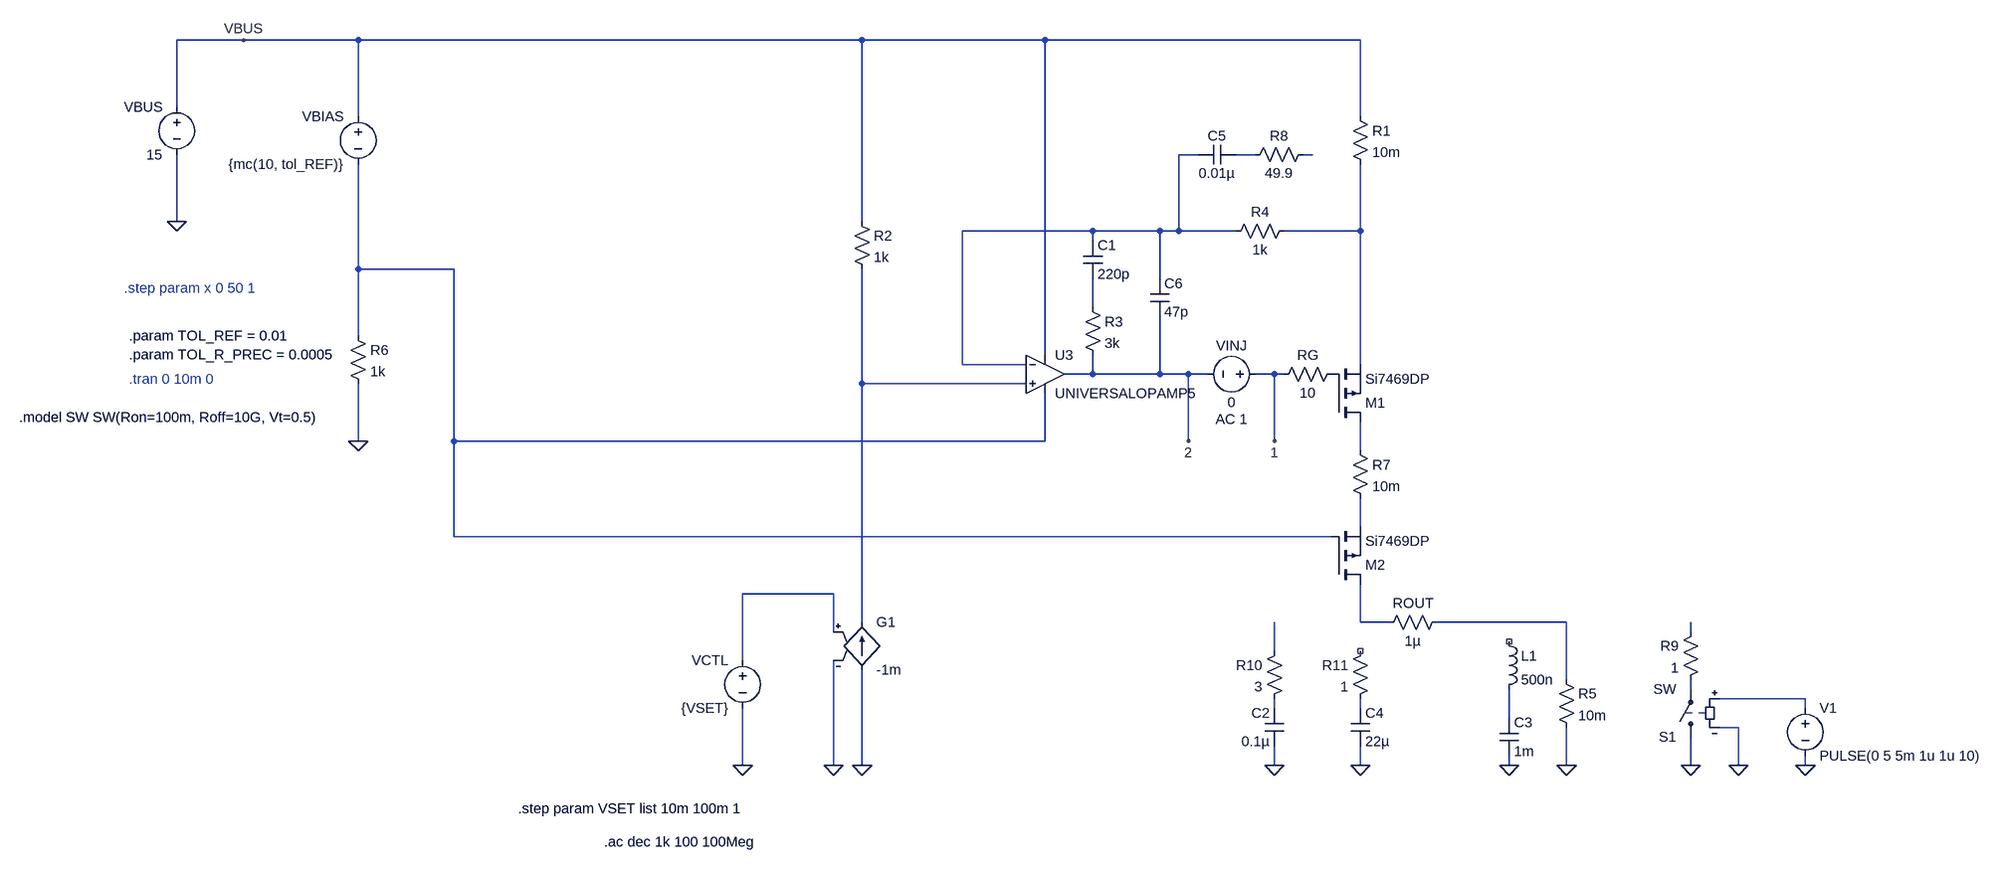
[diagram p0: schematic Voltage_Controlled_Current_Source_AC_Sim.asc]
Voltage_Controlled_Current_Source_AC_Sim.asc, the LTspice schematic file:
Version 4
SHEET 1 2248 1328
WIRE -1600 -32 -1712 -32
WIRE -1408 -32 -1600 -32
WIRE 256 -32 -1408 -32
WIRE 656 -32 256 -32
WIRE 1184 -32 656 -32
WIRE -1712 80 -1712 -32
WIRE -1408 96 -1408 -32
WIRE 1184 96 1184 -32
WIRE 912 160 880 160
WIRE 1008 160 976 160
WIRE 1104 160 1088 160
WIRE -1712 272 -1712 160
WIRE 256 272 256 -32
WIRE 736 288 496 288
WIRE 848 288 736 288
WIRE 880 288 880 160
WIRE 880 288 848 288
WIRE 976 288 880 288
WIRE 1184 288 1184 176
WIRE 1184 288 1056 288
WIRE 736 304 736 288
WIRE -1408 352 -1408 176
WIRE -1184 352 -1408 352
WIRE 848 368 848 288
WIRE 736 416 736 368
WIRE -1408 464 -1408 352
WIRE 656 496 656 -32
WIRE 496 512 496 288
WIRE 624 512 496 512
WIRE 1184 512 1184 288
WIRE 736 528 736 496
WIRE 736 528 688 528
WIRE 848 528 848 432
WIRE 848 528 736 528
WIRE 896 528 848 528
WIRE 928 528 896 528
WIRE 1040 528 1008 528
WIRE 1056 528 1040 528
WIRE 256 544 256 352
WIRE 624 544 256 544
WIRE -1408 640 -1408 544
WIRE -1184 640 -1184 352
WIRE 656 640 656 560
WIRE 656 640 -1184 640
WIRE 896 640 896 528
WIRE 1040 640 1040 528
WIRE 1184 656 1184 608
WIRE 1184 784 1184 736
WIRE -1184 800 -1184 640
WIRE 1136 800 -1184 800
WIRE 208 896 -144 896
WIRE 256 944 256 544
WIRE 1184 944 1184 880
WIRE 1232 944 1184 944
WIRE 1536 944 1312 944
WIRE 208 960 208 896
WIRE 1744 960 1744 944
WIRE 1040 992 1040 944
WIRE -144 1008 -144 896
WIRE 1536 1040 1536 944
WIRE 1744 1056 1744 1040
WIRE 1936 1072 1792 1072
WIRE 1040 1088 1040 1072
WIRE 1184 1088 1184 1072
WIRE 1936 1088 1936 1072
WIRE 1440 1104 1440 1056
WIRE 1824 1120 1792 1120
WIRE -144 1184 -144 1088
WIRE 208 1184 208 1008
WIRE 256 1184 256 1024
WIRE 1040 1184 1040 1152
WIRE 1184 1184 1184 1152
WIRE 1440 1184 1440 1168
WIRE 1536 1184 1536 1120
WIRE 1744 1184 1744 1136
WIRE 1824 1184 1824 1120
WIRE 1936 1184 1936 1168
FLAG -1408 640 0
FLAG -1712 272 0
FLAG -1600 -32 VBUS
FLAG 1536 1184 0
FLAG 1744 1184 0
FLAG 1936 1184 0
FLAG 1824 1184 0
FLAG 1440 1184 0
FLAG 1184 1184 0
FLAG 1040 1184 0
FLAG 256 1184 0
FLAG -144 1184 0
FLAG 208 1184 0
FLAG 896 640 2
FLAG 1040 640 1
SYMBOL voltage -1408 80 M0
WINDOW 123 0 0 Left 0
WINDOW 39 0 0 Left 0
SYMATTR InstName VBIAS
SYMATTR Value {mc(10, tol_REF)}
SYMBOL res -1424 448 R0
SYMATTR InstName R6
SYMATTR Value 1k
SYMBOL voltage -1712 64 M0
WINDOW 123 0 0 Left 0
WINDOW 39 0 0 Left 0
SYMATTR InstName VBUS
SYMATTR Value 15
SYMBOL OpAmps\\UniversalOpAmp5 656 528 R0
SYMATTR InstName U3
SYMATTR Value2 Avol=1Meg GBW=330Meg Phimargin=60 SlewPos=500Meg SlewNeg=500Meg
SYMATTR SpiceLine2 Vos=0 Ibp=2n Ibn=1n Iq=1m Rail=50m Ilimit=50m
SYMBOL pmos 1136 608 M180
SYMATTR InstName M1
SYMATTR Value Si7469DP
SYMBOL res 1520 1024 R0
SYMATTR InstName R5
SYMATTR Value 10m
SYMBOL sw 1744 1152 R180
SYMATTR InstName S1
SYMBOL res 1760 944 M0
SYMATTR InstName R9
SYMATTR Value 1
SYMBOL res 1152 512 R90
WINDOW 0 0 56 VBottom 2
WINDOW 3 32 56 VTop 2
SYMATTR InstName RG
SYMATTR Value 10
SYMBOL voltage 1936 1072 R0
WINDOW 123 0 0 Left 0
WINDOW 39 0 0 Left 0
SYMATTR InstName V1
SYMATTR Value PULSE(0 5 5m 1u 1u 10)
SYMBOL res 1216 960 R270
WINDOW 0 32 56 VTop 2
WINDOW 3 0 56 VBottom 2
SYMATTR InstName ROUT
SYMATTR Value 1µ
SYMBOL cap 1424 1104 R0
SYMATTR InstName C3
SYMATTR Value 1m
SYMBOL ind 1424 960 R0
SYMATTR InstName L1
SYMATTR Value 500n
SYMBOL pmos 1136 880 M180
SYMATTR InstName M2
SYMATTR Value Si7469DP
SYMBOL res 1056 976 M0
SYMATTR InstName R10
SYMATTR Value 3
SYMBOL res 1200 976 M0
SYMATTR InstName R11
SYMATTR Value 1
SYMBOL cap 1056 1088 M0
SYMATTR InstName C2
SYMATTR Value 0.1µ
SYMBOL cap 1168 1088 R0
SYMATTR InstName C4
SYMATTR Value 22µ
SYMBOL res 1168 80 R0
SYMATTR InstName R1
SYMATTR Value 10m
SYMBOL res 240 256 R0
SYMATTR InstName R2
SYMATTR Value 1k
SYMBOL g 256 928 R0
SYMATTR InstName G1
SYMATTR Value -1m
SYMBOL voltage -144 992 M0
WINDOW 123 0 0 Left 0
WINDOW 39 0 0 Left 0
SYMATTR InstName VCTL
SYMATTR Value {VSET}
SYMBOL cap 720 304 R0
SYMATTR InstName C1
SYMATTR Value 220p
SYMBOL res 720 400 R0
SYMATTR InstName R3
SYMATTR Value 3k
SYMBOL res 1072 272 R90
WINDOW 0 0 56 VBottom 2
WINDOW 3 32 56 VTop 2
SYMATTR InstName R4
SYMATTR Value 1k
SYMBOL res 1168 640 R0
SYMATTR InstName R7
SYMATTR Value 10m
SYMBOL voltage 1024 528 R90
WINDOW 0 -32 56 VBottom 2
WINDOW 3 32 56 VTop 2
WINDOW 123 60 56 VTop 2
WINDOW 39 0 0 Left 0
SYMATTR InstName VINJ
SYMATTR Value 0
SYMATTR Value2 AC 1
SYMBOL cap 976 144 R90
WINDOW 0 0 32 VBottom 2
WINDOW 3 32 32 VTop 2
SYMATTR InstName C5
SYMATTR Value 0.01µ
SYMBOL res 1104 144 R90
WINDOW 0 0 56 VBottom 2
WINDOW 3 32 56 VTop 2
SYMATTR InstName R8
SYMATTR Value 49.9
SYMBOL cap 832 368 R0
SYMATTR InstName C6
SYMATTR Value 47p
TEXT -1792 464 Left 2 !.param TOL_REF = 0.01\n.param TOL_R_PREC = 0.0005
TEXT -1800 384 Left 2 ;.step param x 0 50 1
TEXT -1792 536 Left 2 ;.tran 0 10m 0
TEXT -1976 600 Left 2 !.model SW SW(Ron=100m, Roff=10G, Vt=0.5)
TEXT -520 1256 Left 2 !.step param VSET list 10m 100m 1
TEXT -376 1312 Left 2 !.ac dec 1k 100 100Meg

The netlist it stands for:
* Voltage_Controlled_Current_Source_AC_Sim.asc
VBIAS VBUS N005 {mc(10, tol_REF)}
R6 N005 0 1k
VBUS VBUS 0 15
XU3 N007 N001 VBUS N005 2 Avol=1Meg GBW=330Meg Phimargin=60 SlewPos=500Meg SlewNeg=500Meg Vos=0 Ibp=2n Ibn=1n Iq=1m Rail=50m Ilimit=50m  ; UNIVERSALOPAMP5, pins In+ In- V+ V- OUT
M1 N008 P001 N004 N004 Si7469DP
R5 N012 0 10m
S1 0 N015 N016 0 SW
R9 N013 N015 1
RG P001 1 10
V1 N016 0 PULSE(0 5 5m 1u 1u 10)
ROUT N011 N012 1µ
C3 N019 0 1m
L1 NC_01 N019 500n
M2 N011 N005 N009 N009 Si7469DP
R10 N014 N017 3
R11 NC_02 N018 1
C2 N017 0 0.1µ
C4 N018 0 22µ
R1 VBUS N004 10m
R2 VBUS N007 1k
G1 0 N007 N010 0 -1m
VCTL N010 0 {VSET}
C1 N001 N006 220p
R3 N006 2 3k
R4 N004 N001 1k
R7 N008 N009 10m
VINJ 1 2 0 AC 1
C5 N002 N001 0.01µ
R8 N003 N002 49.9
C6 N001 2 47p
.model NMOS NMOS
.model PMOS PMOS
.lib standard.mos
.param TOL_REF = 0.01
.param TOL_R_PREC = 0.0005
* .step param x 0 50 1
* .tran 0 10m 0
.model SW SW(Ron=100m, Roff=10G, Vt=0.5)
.step param VSET list 10m 100m 1
.ac dec 1k 100 100Meg
.backanno
.end